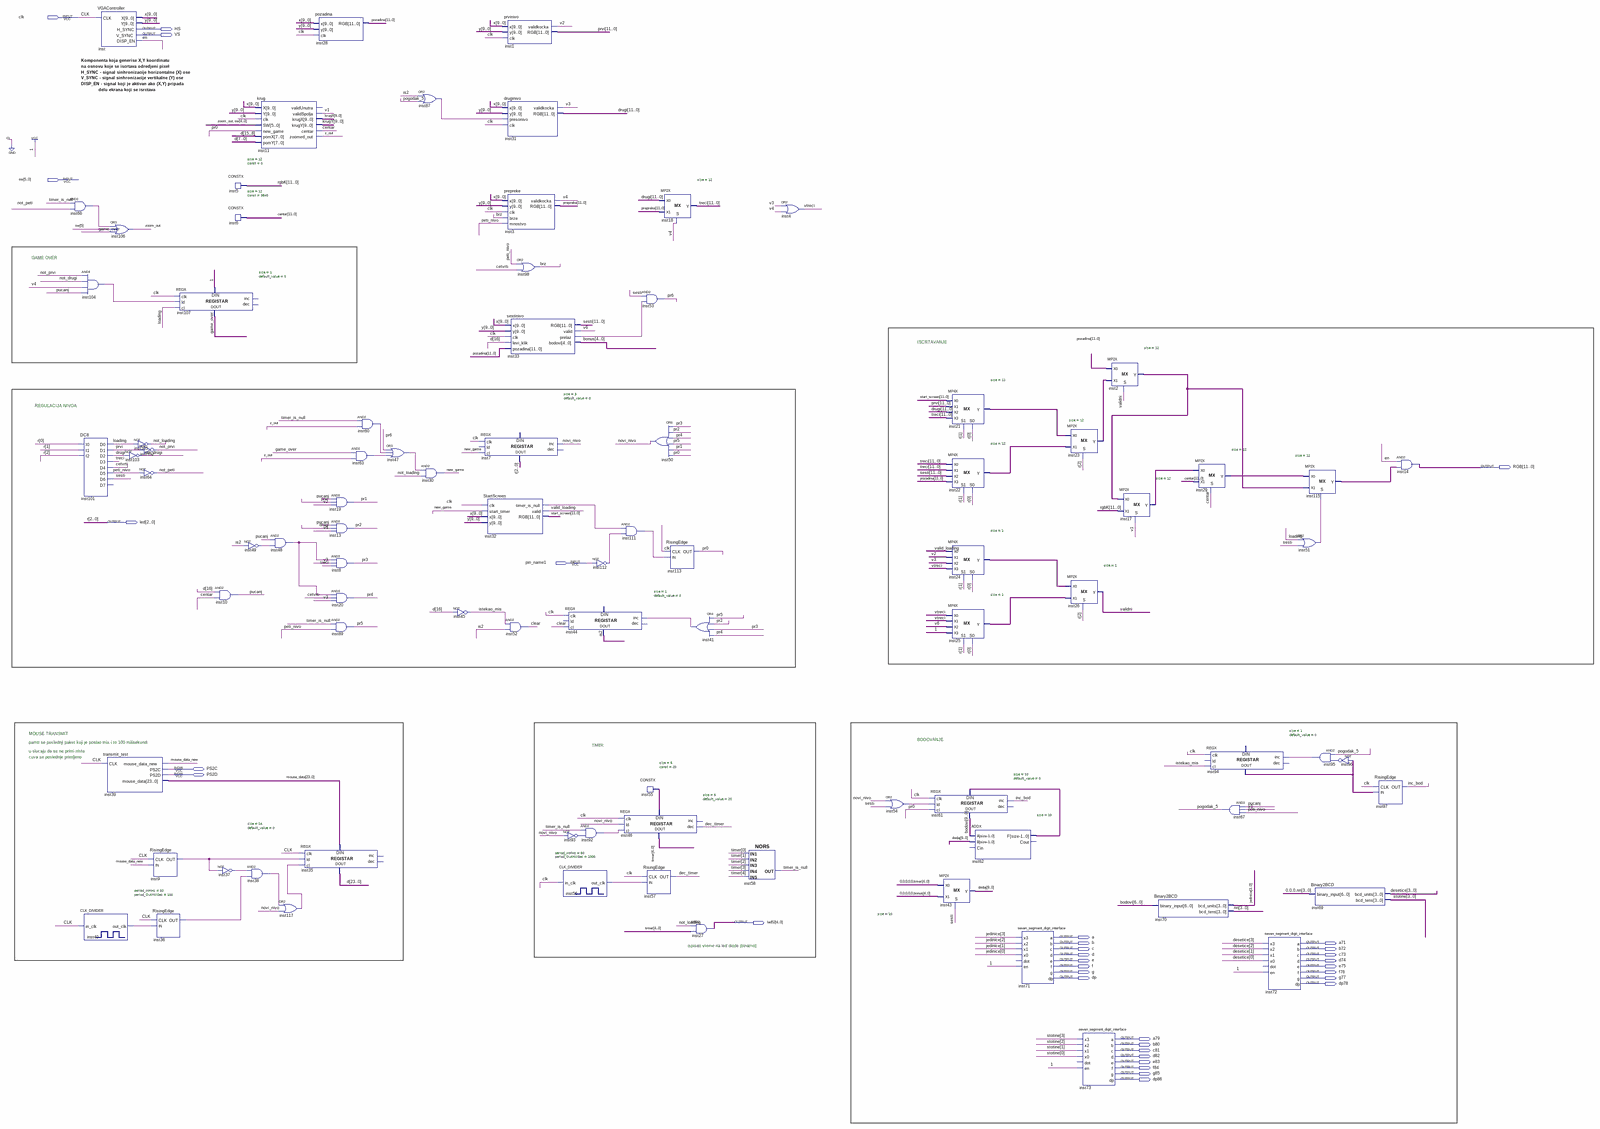
[diagram p0: schematic sheet, whole]
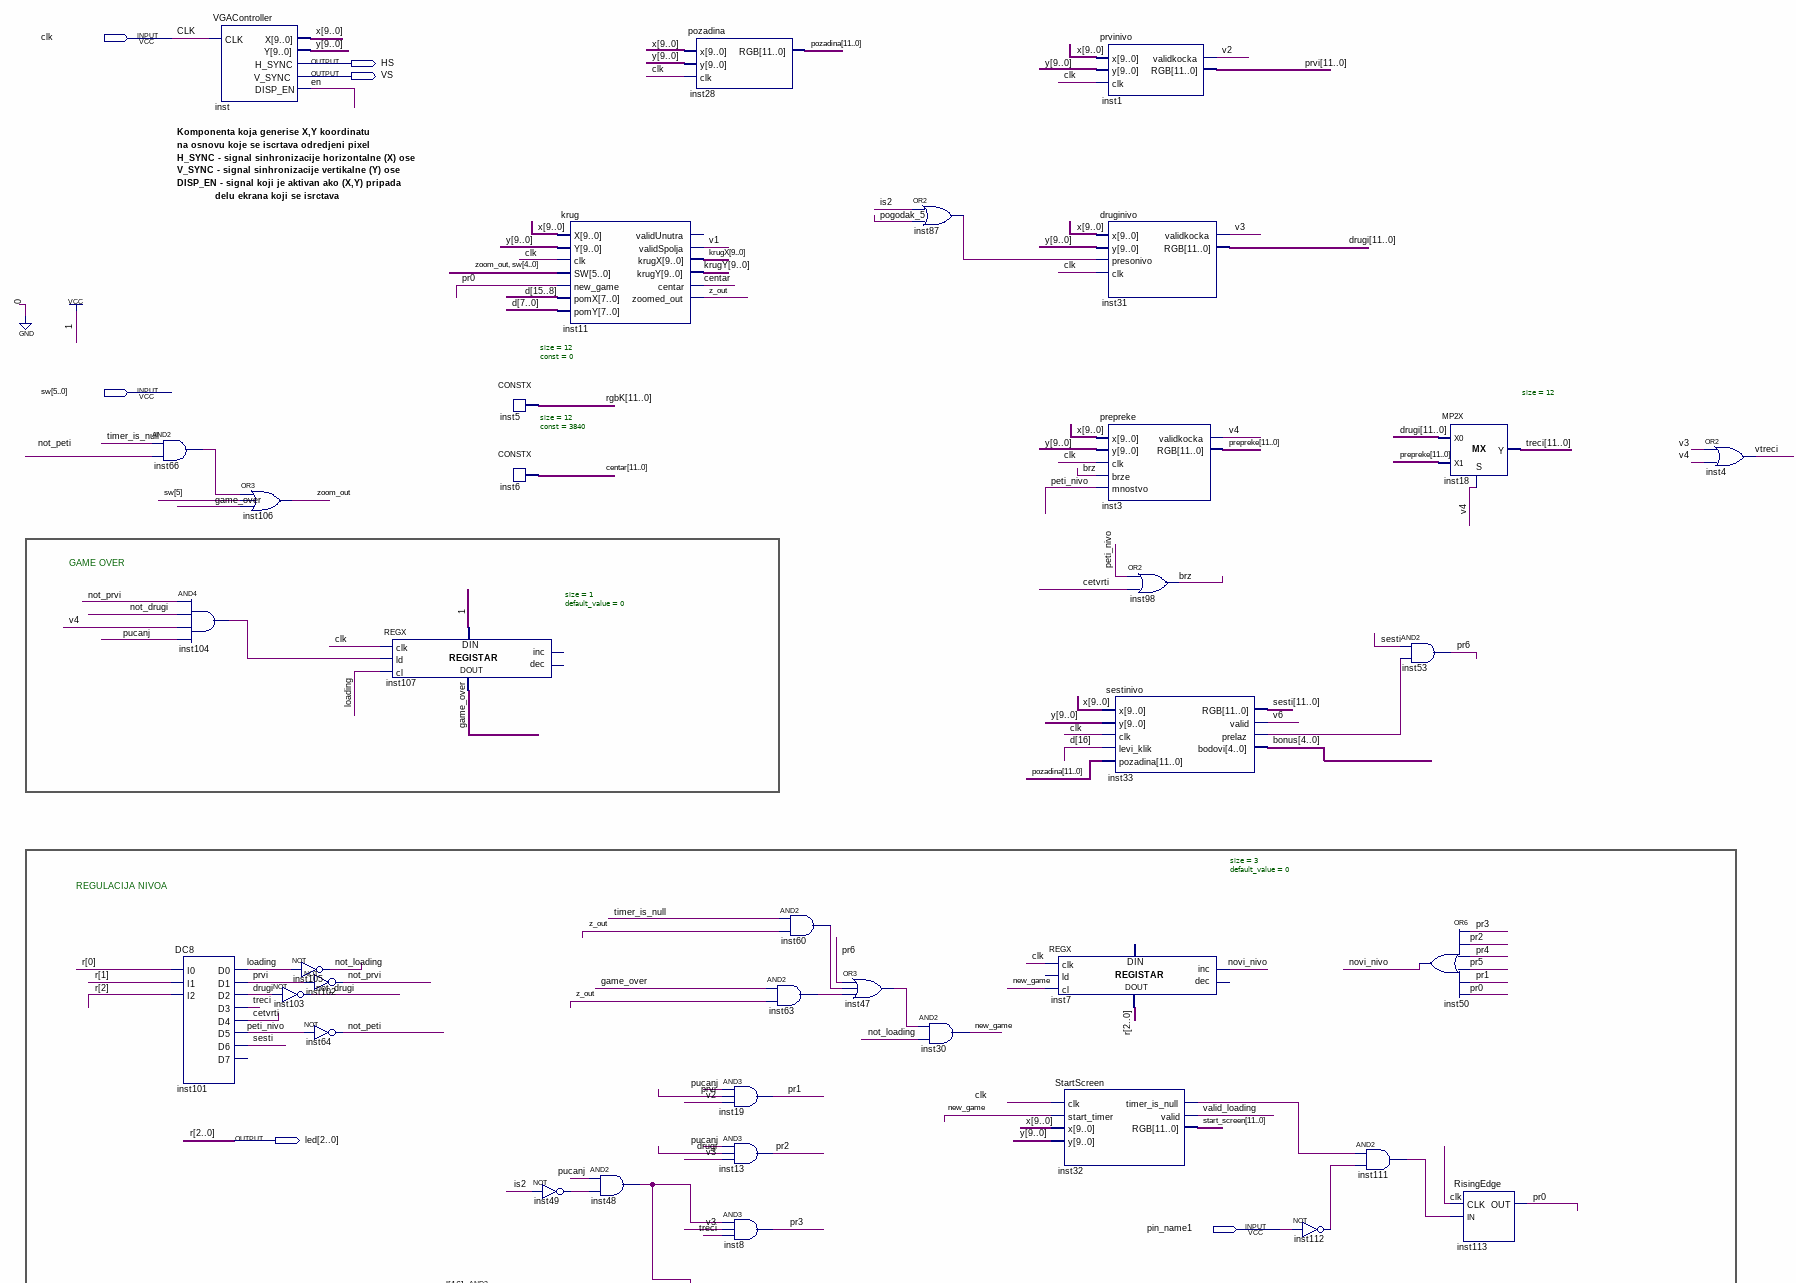
[diagram p1: schematic sheet, upper left part]
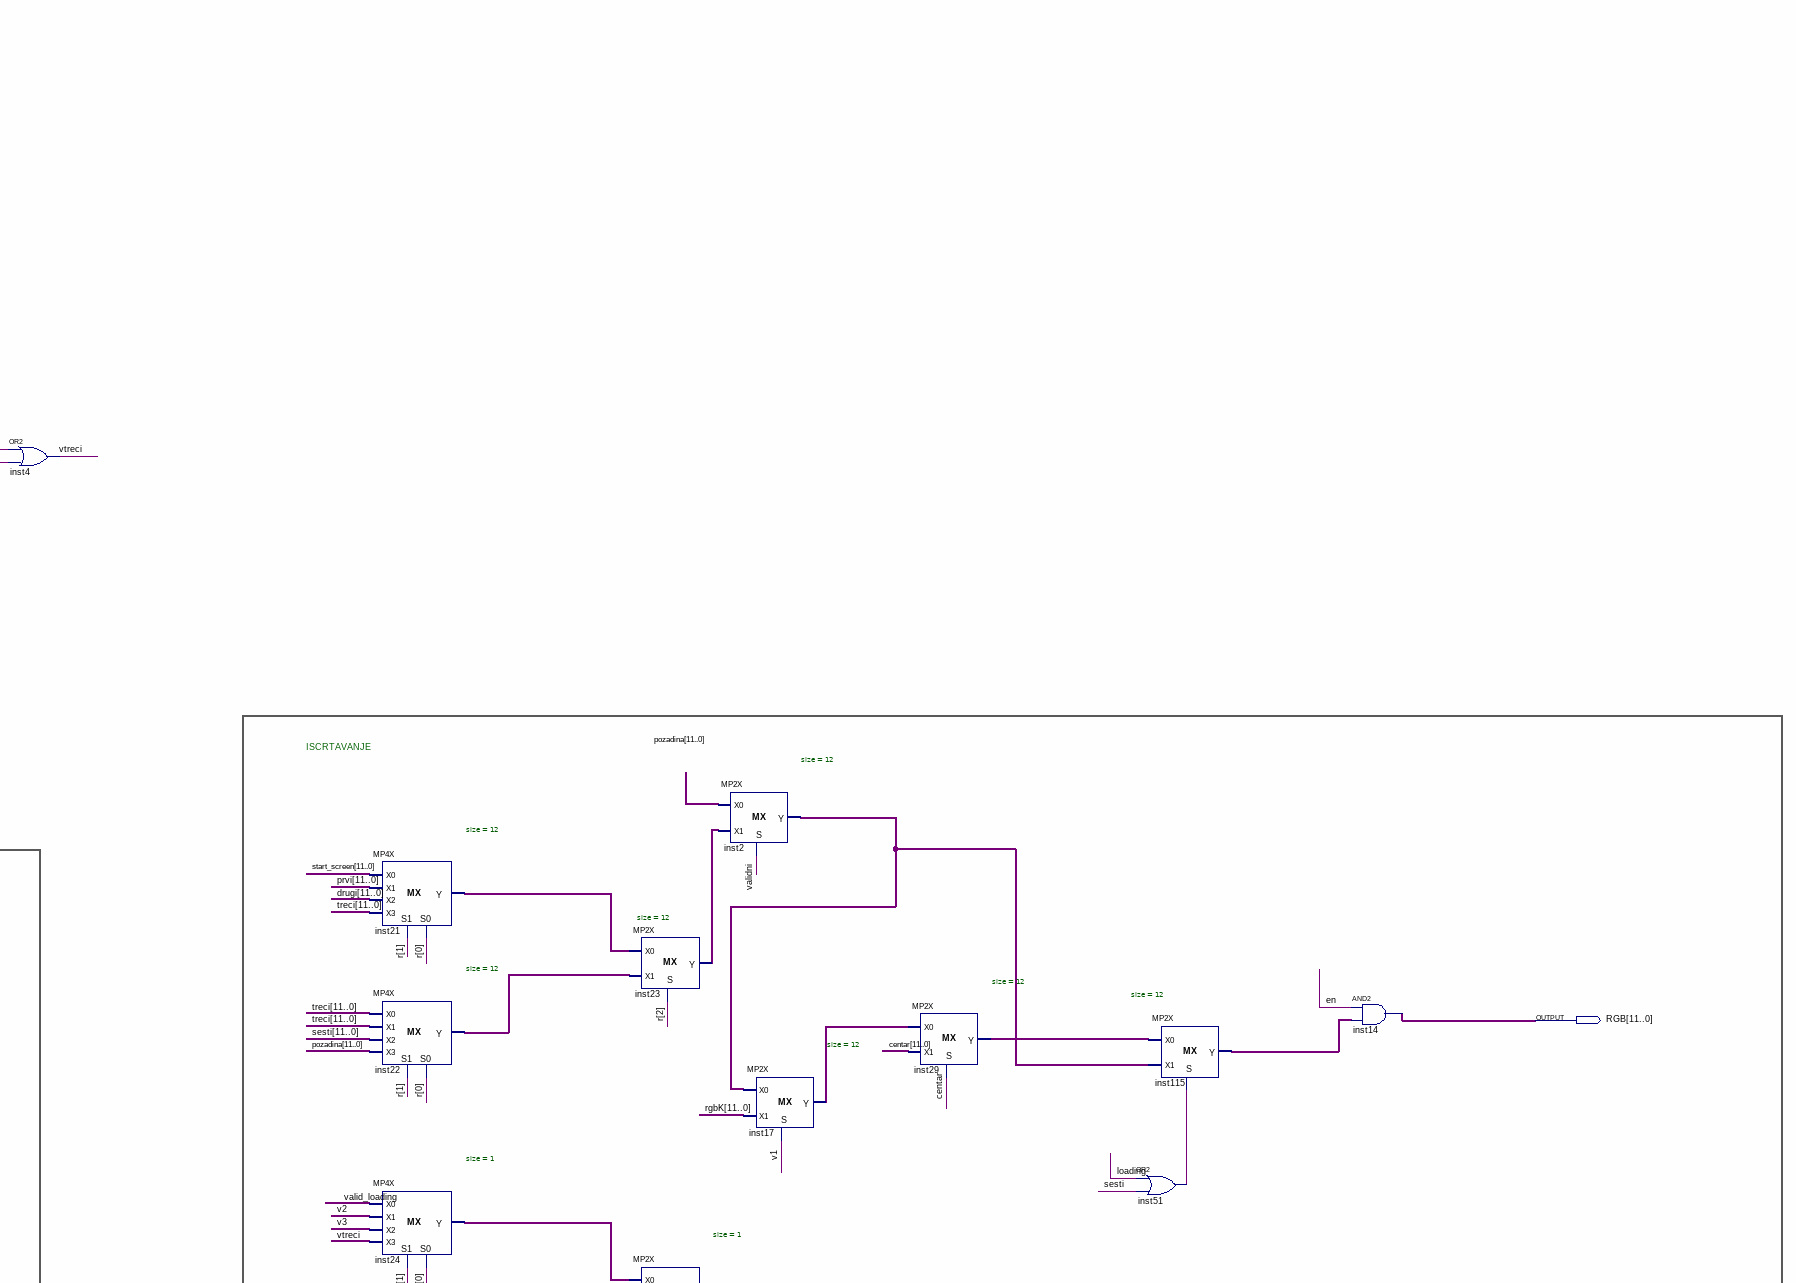
[diagram p2: schematic sheet, upper right part]
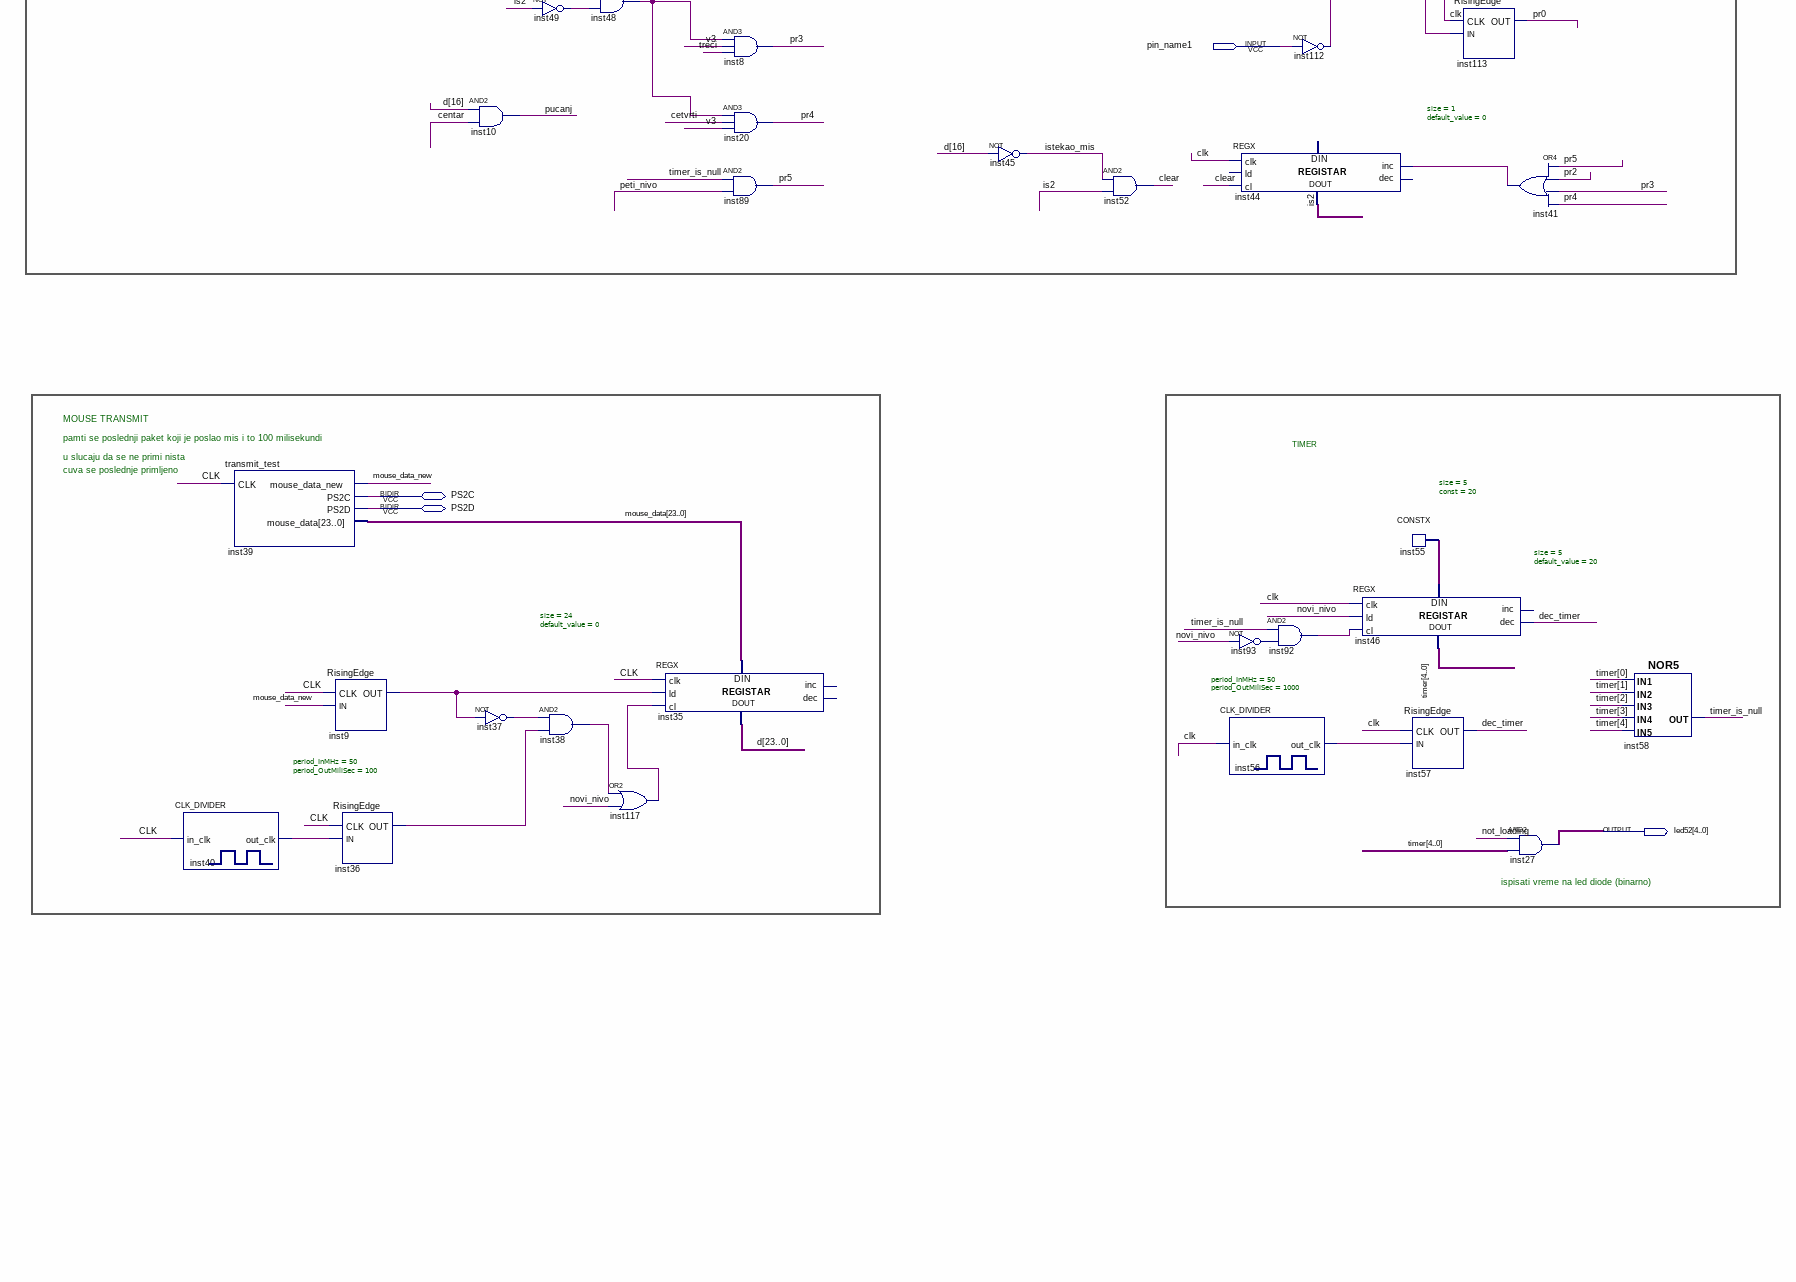
[diagram p3: schematic sheet, lower left part]
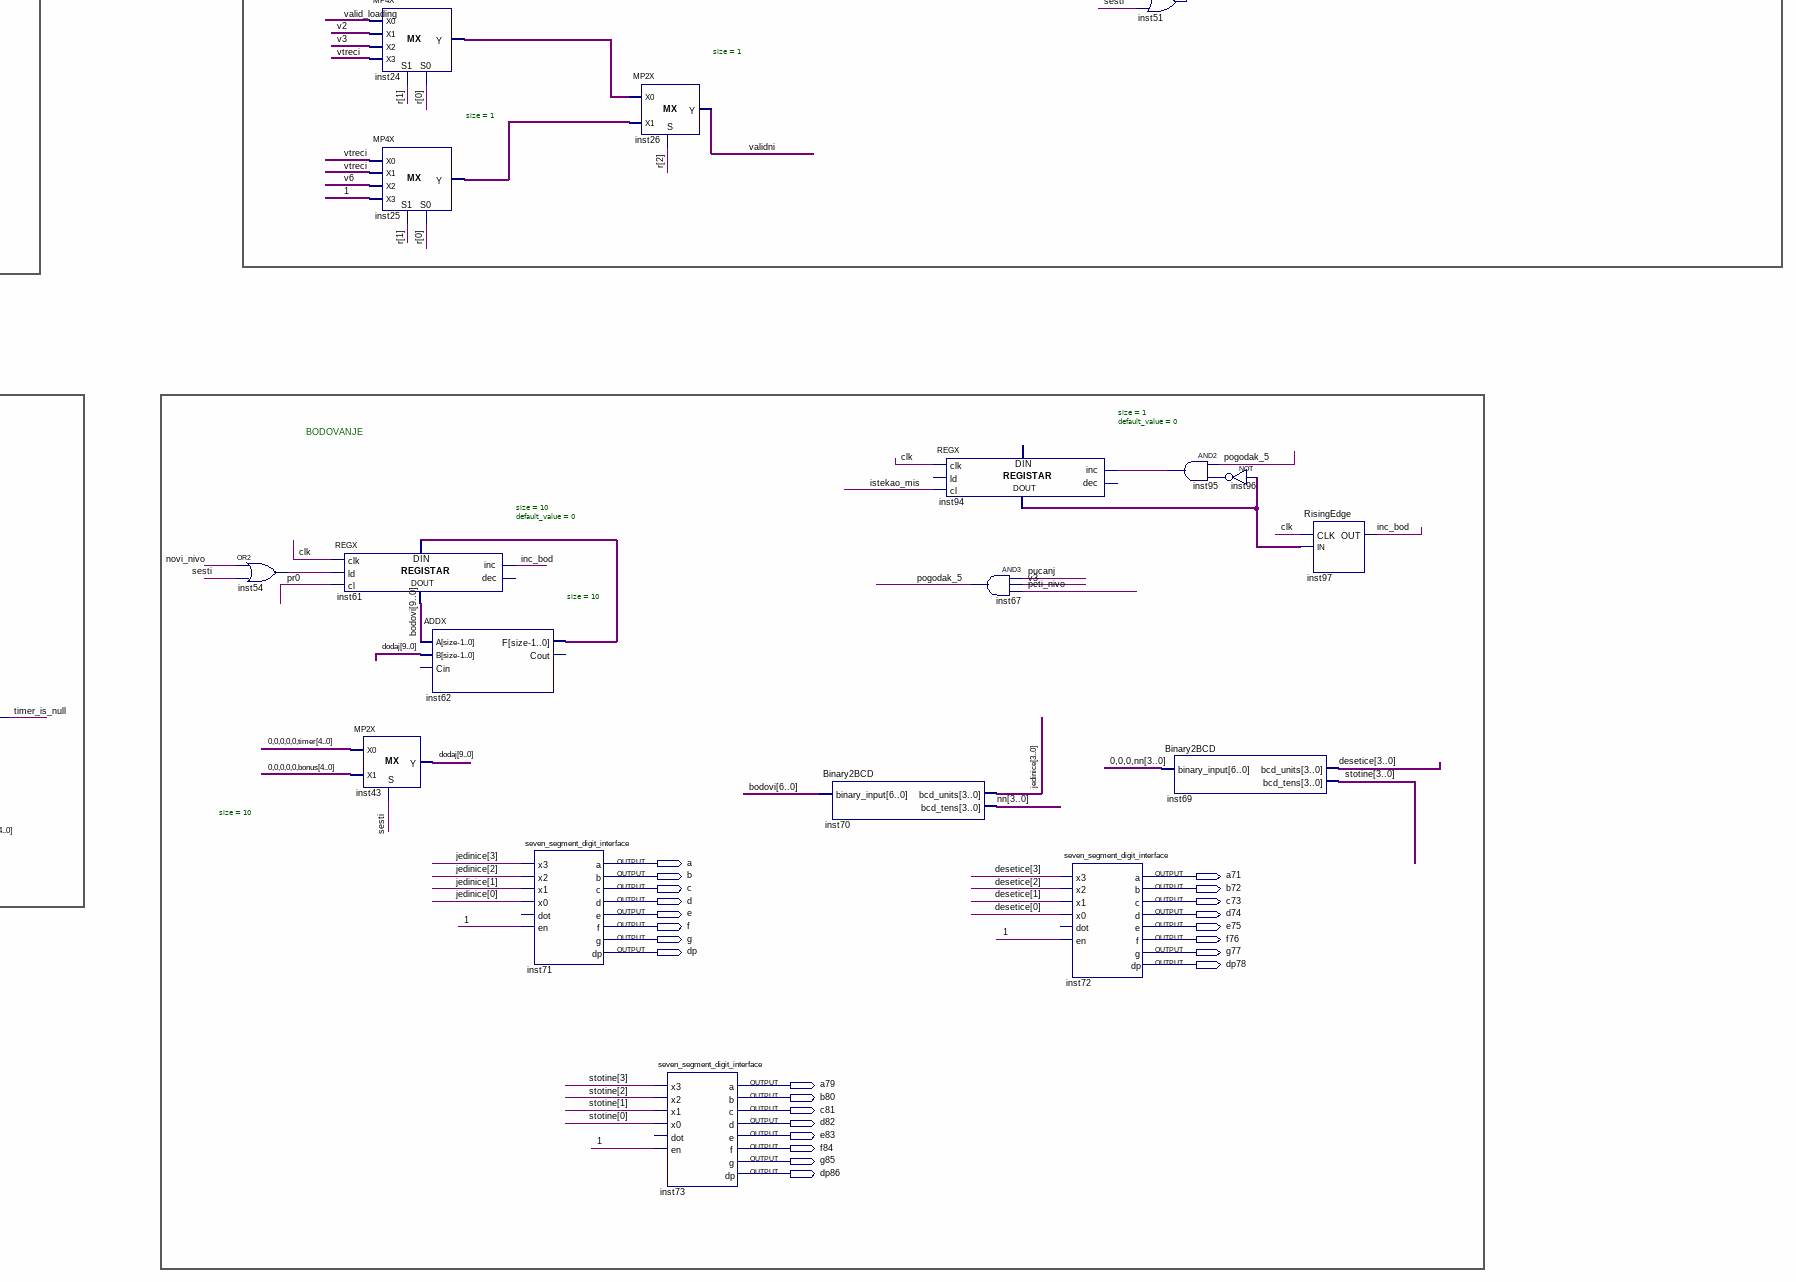
[diagram p4: schematic sheet, lower right part]
// Quartus schematic pokusaj.bdf as structural Verilog: 87 symbols, 34 pins
module pokusaj (
  input  clk,
  input  [5:0] sw,
  input  pin_name1,
  inout  PS2C,
  inout  PS2D,
  output HS,
  output VS,
  output [11:0] RGB,
  output [2:0] led,
  output [4:0] led52,
  output a,
  output b,
  output a71,
  output c,
  output b72,
  output d,
  output c73,
  output e,
  output d74,
  output f,
  output e75,
  output g,
  output f76,
  output dp,
  output g77,
  output dp78,
  output a79,
  output b80,
  output c81,
  output d82,
  output e83,
  output f84,
  output g85,
  output dp86
);

  wire brz, centar_1bit, cetvrti, clear, dec_timer, drugi_1bit, en, game_over, inc_bod, inst9_out, inst24_y,
       inst25_y, inst32_timer_is_null, inst33_prelaz, inst36_out, inst37_out, inst38_out, inst40_out_clk,
       inst41_out, inst47_out, inst48_out, inst49_out, inst51_out, inst54_out, inst56_out_clk, inst60_out,
       inst63_out, inst66_out, inst87_out, inst92_out, inst93_out, inst94_data_out, inst95_out, inst96_out,
       inst104_out, inst111_out, inst112_out, inst117_out, is2, istekao_mis, loading, mouse_data_new,
       new_game, not_drugi, not_loading, not_peti, not_prvi, novi_nivo, peti_nivo, pogodak_5, pr0, pr1, pr2,
       pr3, pr4, pr5, pr6, prvi_1bit, pucanj, sesti_1bit, timer_is_null, treci_1bit, v1, v2, v3, v4, v6,
       valid_loading, validni, vtreci, z_out, zoom_out;
  wire [3:0] desetice, jedinice, nn, stotine;
  wire [4:0] bonus, inst55_data, timer;
  wire [9:0] bodovi, dodaj, inst62_f, krugX, krugY, x, y;
  wire [11:0] centar, drugi, inst2_y, inst17_y, inst21_y, inst22_y, inst23_y, inst29_y, inst115_y, pozadina,
       prepreke, prvi, rgbK, sesti, start_screen, treci;
  wire [23:0] d_bus, mouse_data;

  and inst66 (inst66_out, timer_is_null, not_peti);
  VGAController inst (.CLK(clk), .X(x), .Y(y), .H_SYNC(HS), .V_SYNC(VS), .DISP_EN(en));
  and inst104 (inst104_out, not_prvi, not_drugi, v4, pucanj);
  DC8 inst101 (
    .I0(led[0]), .I1(led[1]), .I2(led[2]), .D0(loading), .D1(prvi_1bit), .D2(drugi_1bit), .D3(treci_1bit),
    .D4(cetvrti), .D5(peti_nivo), .D6(sesti_1bit));  // open: D7
  CLK_DIVIDER #(.period_InMHz(50), .period_OutMiliSec(100)) inst40 (.in_clk(clk), .out_clk(inst40_out_clk));
  or inst106 (zoom_out, inst66_out, sw[5], game_over);
  transmit_test inst39 (.CLK(clk), .mouse_data_new(mouse_data_new), .mouse_data(mouse_data), .PS2C(PS2C), .PS2D(PS2D));
  not inst105 (not_loading, loading);
  not inst102 (not_prvi, prvi_1bit);
  not inst103 (not_drugi, drugi_1bit);
  not inst64 (not_peti, peti_nivo);
  RisingEdge inst9 (.CLK(clk), .IN(mouse_data_new), .OUT(inst9_out));
  RisingEdge inst36 (.CLK(clk), .IN(inst40_out_clk), .OUT(inst36_out));
  REGX #(.size(1), .default_value(0)) inst107 (
    .clk(clk), .ld(inst104_out), .cl(loading), .data_in(1'b1), .data_out(game_over));  // open: inc, dec
  CONSTX #(.size(12), .\const (0)) inst5 (.data(rgbK));
  CONSTX #(.size(12), .\const (3840)) inst6 (.data(centar));
  and inst10 (pucanj, d_bus[16], centar_1bit);
  not inst37 (inst37_out, inst9_out);
  krug inst11 (
    .X(x), .Y(y), .clk(clk), .SW({zoom_out, sw[4:0]}), .new_game(pr0), .pomX(d_bus[15:8]), .pomY(d_bus[7:0]),
    .validSpolja(v1), .krugX(krugX), .krugY(krugY), .centar(centar_1bit), .zoomed_out(z_out));  // open: validUnutra
  not inst49 (inst49_out, is2);
  and inst38 (inst38_out, inst37_out, inst36_out);
  and inst48 (inst48_out, pucanj, inst49_out);
  or inst117 (inst117_out, inst38_out, novi_nivo);
  REGX #(.size(24), .default_value(0)) inst35 (
    .clk(clk), .ld(inst9_out), .cl(inst117_out), .data_in(mouse_data), .data_out(d_bus));  // open: inc, dec
  pozadina inst28 (.x(x), .y(y), .clk(clk), .RGB(pozadina));
  and inst63 (inst63_out, game_over, z_out);
  and inst19 (pr1, pucanj, prvi_1bit, v2);
  and inst13 (pr2, pucanj, drugi_1bit, v3);
  and inst8 (pr3, inst48_out, v3, treci_1bit);
  and inst20 (pr4, inst48_out, cetvrti, v3);
  and inst89 (pr5, timer_is_null, peti_nivo);
  and inst60 (inst60_out, timer_is_null, z_out);
  or inst47 (inst47_out, pr6, inst60_out, inst63_out);
  or inst87 (inst87_out, is2, pogodak_5);
  and inst30 (new_game, inst47_out, not_loading);
  not inst45 (istekao_mis, d_bus[16]);
  REGX #(.size(3), .default_value(0)) inst7 (
    .clk(clk), .cl(new_game), .inc(novi_nivo), .data_out(led));  // open: ld, dec, data_in
  StartScreen inst32 (
    .clk(clk), .start_timer(new_game), .x(x), .y(y), .timer_is_null(inst32_timer_is_null),
    .valid(valid_loading), .RGB(start_screen));
  prvinivo inst1 (.x(x), .y(y), .clk(clk), .validkocka(v2), .RGB(prvi));
  druginivo inst31 (.x(x), .y(y), .presonivo(inst87_out), .clk(clk), .validkocka(v3), .RGB(drugi));
  prepreke inst3 (.x(x), .y(y), .clk(clk), .brze(brz), .mnostvo(peti_nivo), .validkocka(v4), .RGB(prepreke));
  sestinivo inst33 (
    .x(x), .y(y), .clk(clk), .levi_klik(d_bus[16]), .pozadina(pozadina), .RGB(sesti), .valid(v6),
    .prelaz(inst33_prelaz), .bodovi(bonus));
  and inst52 (clear, istekao_mis, is2);
  or inst98 (brz, peti_nivo, cetvrti);
  CLK_DIVIDER #(.period_InMHz(50), .period_OutMiliSec(1000)) inst56 (.in_clk(clk), .out_clk(inst56_out_clk));
  REGX #(.size(1), .default_value(0)) inst44 (
    .clk(clk), .cl(clear), .inc(inst41_out), .data_out(is2));  // open: ld, dec, data_in
  and inst92 (inst92_out, timer_is_null, inst93_out);
  not inst93 (inst93_out, novi_nivo);
  not inst112 (inst112_out, pin_name1);
  and inst111 (inst111_out, inst32_timer_is_null, inst112_out);
  REGX #(.size(5), .default_value(20)) inst46 (
    .clk(clk), .ld(novi_nivo), .cl(inst92_out), .dec(dec_timer), .data_in(inst55_data), .data_out(timer));  // open: inc
  and inst53 (pr6, sesti_1bit, inst33_prelaz);
  or inst50 (novi_nivo, pr3, pr2, pr4, pr5, pr1, pr0);
  CONSTX #(.size(5), .\const (20)) inst55 (.data(inst55_data));
  RisingEdge inst57 (.CLK(clk), .IN(inst56_out_clk), .OUT(dec_timer));
  MP2X #(.size(12)) inst18 (.S(v4), .X0(drugi), .X1(prepreke), .Y(treci));
  RisingEdge inst113 (.CLK(clk), .IN(inst111_out), .OUT(pr0));
  or inst41 (inst41_out, pr5, pr2, pr3, pr4);
  assign led52 = {5{not_loading}} & timer;  // AND2 inst27, 5 bits wide
  nor inst58 (timer_is_null, timer[0], timer[1], timer[2], timer[3], timer[4]);
  or inst4 (vtreci, v3, v4);
  or inst54 (inst54_out, novi_nivo, sesti_1bit);
  REGX #(.size(10), .default_value(0)) inst61 (
    .clk(clk), .ld(inst54_out), .cl(pr0), .inc(inc_bod), .data_in(inst62_f), .data_out(bodovi));  // open: dec
  MP4X #(.size(12)) inst21 (
    .S0(led[0]), .S1(led[1]), .X0(start_screen), .X1(prvi), .X2(drugi), .X3(treci), .Y(inst21_y));
  MP4X #(.size(12)) inst22 (.S0(led[0]), .S1(led[1]), .X0(treci), .X1(treci), .X2(sesti), .X3(pozadina), .Y(inst22_y));
  MP4X #(.size(1)) inst24 (.S0(led[0]), .S1(led[1]), .X0(valid_loading), .X1(v2), .X2(v3), .X3(vtreci), .Y(inst24_y));
  MP4X #(.size(1)) inst25 (.S0(led[0]), .S1(led[1]), .X0(vtreci), .X1(vtreci), .X2(v6), .X3(1'b1), .Y(inst25_y));
  MP2X #(.size(10)) inst43 (.S(sesti_1bit), .X0({{5{1'b0}}, timer}), .X1({{5{1'b0}}, bonus}), .Y(dodaj));
  ADDX #(.size(10)) inst62 (.A(bodovi), .B(dodaj), .F(inst62_f));  // open: Cin, Cout
  seven_segment_digit_interface inst71 (
    .x3(jedinice[3]), .x2(jedinice[2]), .x1(jedinice[1]), .x0(jedinice[0]), .en(1'b1), .a(a), .b(b), .c(c),
    .d(d), .e(e), .f(f), .g(g), .dp(dp));  // open: dot
  MP2X #(.size(12)) inst23 (.S(led[2]), .X0(inst21_y), .X1(inst22_y), .Y(inst23_y));
  MP2X #(.size(1)) inst26 (.S(led[2]), .X0(inst24_y), .X1(inst25_y), .Y(validni));
  seven_segment_digit_interface inst73 (
    .x3(stotine[3]), .x2(stotine[2]), .x1(stotine[1]), .x0(stotine[0]), .en(1'b1), .a(a79), .b(b80), .c(c81),
    .d(d82), .e(e83), .f(f84), .g(g85), .dp(dp86));  // open: dot
  MP2X #(.size(12)) inst2 (.S(validni), .X0(pozadina), .X1(inst23_y), .Y(inst2_y));
  MP2X #(.size(12)) inst17 (.S(v1), .X0(inst2_y), .X1(rgbK), .Y(inst17_y));
  Binary2BCD inst70 (.binary_input(bodovi[6:0]), .bcd_units(jedinice), .bcd_tens(nn));
  MP2X #(.size(12)) inst29 (.S(centar_1bit), .X0(inst17_y), .X1(centar), .Y(inst29_y));
  REGX #(.size(1), .default_value(0)) inst94 (
    .clk(clk), .cl(istekao_mis), .inc(inst95_out), .data_out(inst94_data_out));  // open: ld, dec, data_in
  and inst67 (pogodak_5, pucanj, v3, peti_nivo);
  seven_segment_digit_interface inst72 (
    .x3(desetice[3]), .x2(desetice[2]), .x1(desetice[1]), .x0(desetice[0]), .en(1'b1), .a(a71), .b(b72),
    .c(c73), .d(d74), .e(e75), .f(f76), .g(g77), .dp(dp78));  // open: dot
  MP2X #(.size(12)) inst115 (.S(inst51_out), .X0(inst29_y), .X1(inst2_y), .Y(inst115_y));
  or inst51 (inst51_out, loading, sesti_1bit);
  and inst95 (inst95_out, pogodak_5, inst96_out);
  Binary2BCD inst69 (.binary_input({3'b000, nn}), .bcd_units(desetice), .bcd_tens(stotine));
  not inst96 (inst96_out, inst94_data_out);
  RisingEdge inst97 (.CLK(clk), .IN(inst94_data_out), .OUT(inc_bod));
  assign RGB = {12{en}} & inst115_y;  // AND2 inst14, 12 bits wide

  // Other names for the same wires on the sheet: r[2:0] = led

  // Notes on the sheet:
  //   Komponenta koja generise X,Y koordinatu
  //   na osnovu koje se iscrtava odredjeni pixel
  //   H_SYNC - signal sinhronizacije horizontalne (X) ose
  //   V_SYNC - signal sinhronizacije vertikalne (Y) ose
  //   DISP_EN - signal koji je aktivan ako (X,Y) pripada        
  //   delu ekrana koji se isrctava
  //   GAME OVER  
  //   ISCRTAVANJE  
  //   REGULACIJA NIVOA   
  //   MOUSE TRANSMIT    
  //   BODOVANJE   
  //   pamti se poslednji paket koji je poslao mis i to 100 milisekundi                       
  //   TIMER  
  //   u slucaju da se ne primi nista    
  //   cuva se poslednje primljeno    
  //   ispisati vreme na led diode (binarno)
endmodule
